# Altium project CAN Breakout.PrjPcb
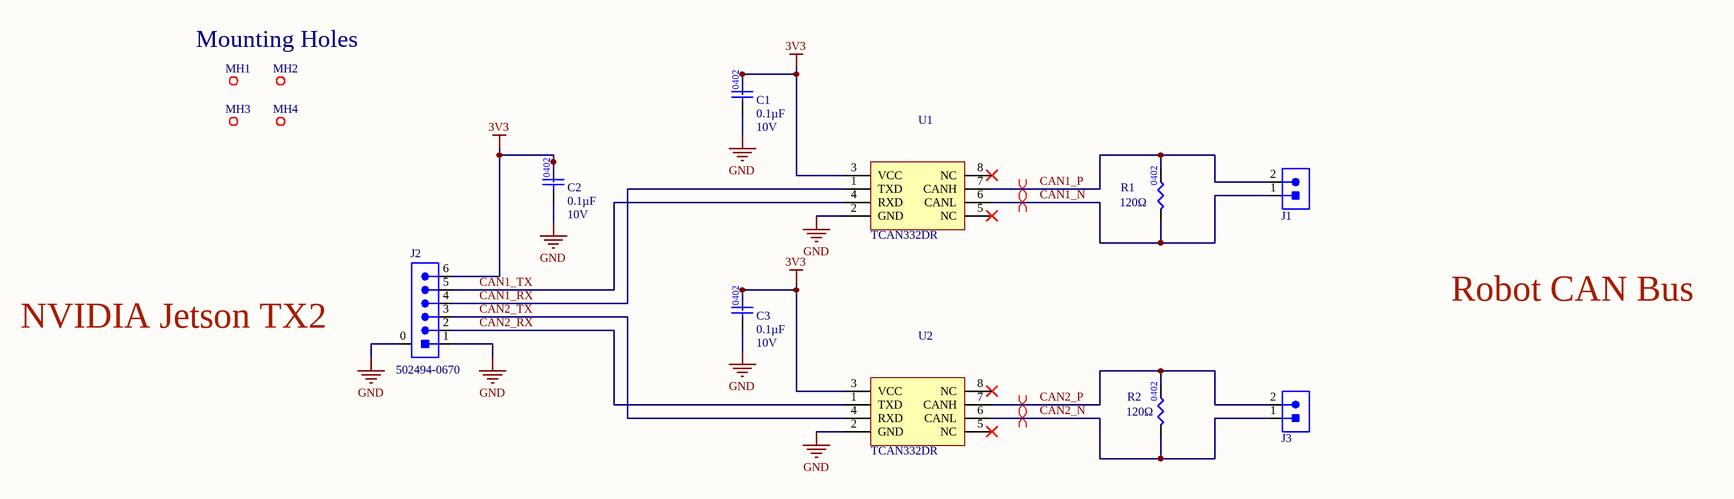
[diagram p0: CAN Breakout.SchDoc]
1 sheet, 14 parts. Net scope: global (net labels, ports and power ports of the same name join across sheets).
Board file: CAN Breakout.PcbDoc

## Sheet CAN Breakout.SchDoc: CAN Breakout
size B; DrawnBy: Sahil Kale; SheetNumber: 1; SheetTotal: 1

### Parts
C1  value 0.1µF  Voltage Rating: 10V  [CAP0402]  (hidden comment: CAP_0.1uF_10V_0402)
C2  value 0.1µF  Voltage Rating: 10V  [CAP0402]  (hidden comment: CAP_0.1uF_10V_0402)
C3  value 0.1µF  Voltage Rating: 10V  [CAP0402]  (hidden comment: CAP_0.1uF_10V_0402)
J1  CON_2POS_SCREW_TERM  [1935161]  (value not drawn)
J2  Manufacturer Part Number 1: 502494-0670  [MOLEX-5024940670]  (hidden comment: CON_6M_SM_RA)
J3  CON_2POS_SCREW_TERM  [1935161]  (value not drawn)
MH1  MOUNTING_HOLE_M3  [MOUNTING_HOLE_3mm]  (value not drawn)  (no BOM)
MH2  MOUNTING_HOLE_M3  [MOUNTING_HOLE_3mm]  (value not drawn)  (no BOM)
MH3  MOUNTING_HOLE_M3  [MOUNTING_HOLE_3mm]  (value not drawn)  (no BOM)
MH4  MOUNTING_HOLE_M3  [MOUNTING_HOLE_3mm]  (value not drawn)  (no BOM)
R1  value 120Ω  [RES0402]  (hidden comment: RES_120Ω_0402_5%)
R2  value 120Ω  [RES0402]  (hidden comment: RES_120Ω_0402_5%)
U1  TCAN332DR  [SOIC127P599X175-8N]
U2  TCAN332DR  [SOIC127P599X175-8N]

### Nets
3V3: C1.2 C2.2 C3.2 J2.6 U1.3(VCC) U2.3(VCC)
GND: C1.1 C2.1 C3.1 J2.0 J2.1 U1.2(GND) U2.2(GND)
CAN1_N: J1.1 R1.1 U1.6(CANL)
CAN1_P: J1.2 R1.2 U1.7(CANH)
CAN1_RX: J2.4 U1.1(TXD)
CAN1_TX: J2.5 U1.4(RXD)
CAN2_N: J3.1 R2.1 U2.6(CANL)
CAN2_P: J3.2 R2.2 U2.7(CANH)
CAN2_RX: J2.2 U2.1(TXD)
CAN2_TX: J2.3 U2.4(RXD)

Not connected (* = marked no-connect by the designer): U1 5(NC)* 8(NC)*; U2 5(NC)* 8(NC)*

### Layout directives
differential pair; differential pair class 120: CAN1_N, CAN1_P, CAN2_N, CAN2_P

### Notes on the sheet
- Mounting Holes
- Robot CAN Bus
- NVIDIA Jetson TX2
- Title:
- Project:
- Date:
- Rev:
- Reviewer:
- Engineer:
- Sheet:
- of
- (in symbol RES_120Ω_0402_5%) 0402

### Library data of the parts
C1-C3 = CAP_0.1uF_10V_0402: CAP CER 0.1UF 10V X7R 0402; Manufacturer 1: Murata Electronics; Manufacturer Part Number 1: GRM155R71A104KA01D; Package/Footprint: 0402; Supplier 1: Digi-Key; Supplier Part Number 1: 490-6321-1-ND
J1 J3 = CON_2POS_SCREW_TERM: TERM BLK 2POS SIDE ENTRY 5MM; Manufacturer 1: Phoenix Contact; Package/Footprint: SMD; Supplier 1: Digi-Key; Mounting Type: TH; Supplier Part Number 1: 277-1667-ND; Manufacturer Part Number 1: 1935161
J2 = CON_6M_SM_RA: CONN HEADER SMD RIGHT ANGLE 2MM PITCH; Manufacturer 1: Molex; Current Rating: 3A; Voltage Rating: 250V; Supplier 1: Digi-Key; Orientation: Right Angle; Pitch: 2mm; Supplier Part Number 1: WM2283CT-ND
R1 = RES_120Ω_0402_5%: RES 120 OHM 5% 1/16W 0402; Manufacturer 1: Yageo; Manufacturer Part Number 1: RC0402JR-07120RL; Package/Footprint: 0402; Supplier 1: Digi-Key; Supplier Part Number 1: 311-120JRCT-ND; Mounting Type: SMD; Power: 1/16W; Tolerance: 5%
R2 = RES_120Ω_0402_5%: RES 120 OHM 5% 1/16W 0402; Manufacturer 1: Yageo; Manufacturer Part Number 1: RC0402JR-07120RL; Supplier 1: Digi-Key; Supplier Part Number 1: 311-120JRCT-ND; Mounting Type: SMD; Power: 1/16W; Tolerance: 5%
U1 U2 = TCAN332DR: IC CAN TRANSCEIVER; Manufacturer 1: Texas Instruments; Manufacturer Part Number 1: TCAN332DR; Supplier 1: Digi-Key; Supplier Part Number 1: 296-43711-1-ND